# EAGLE design Nixie_Clock_ESP32_IN14 (EAGLE 9.6.2)
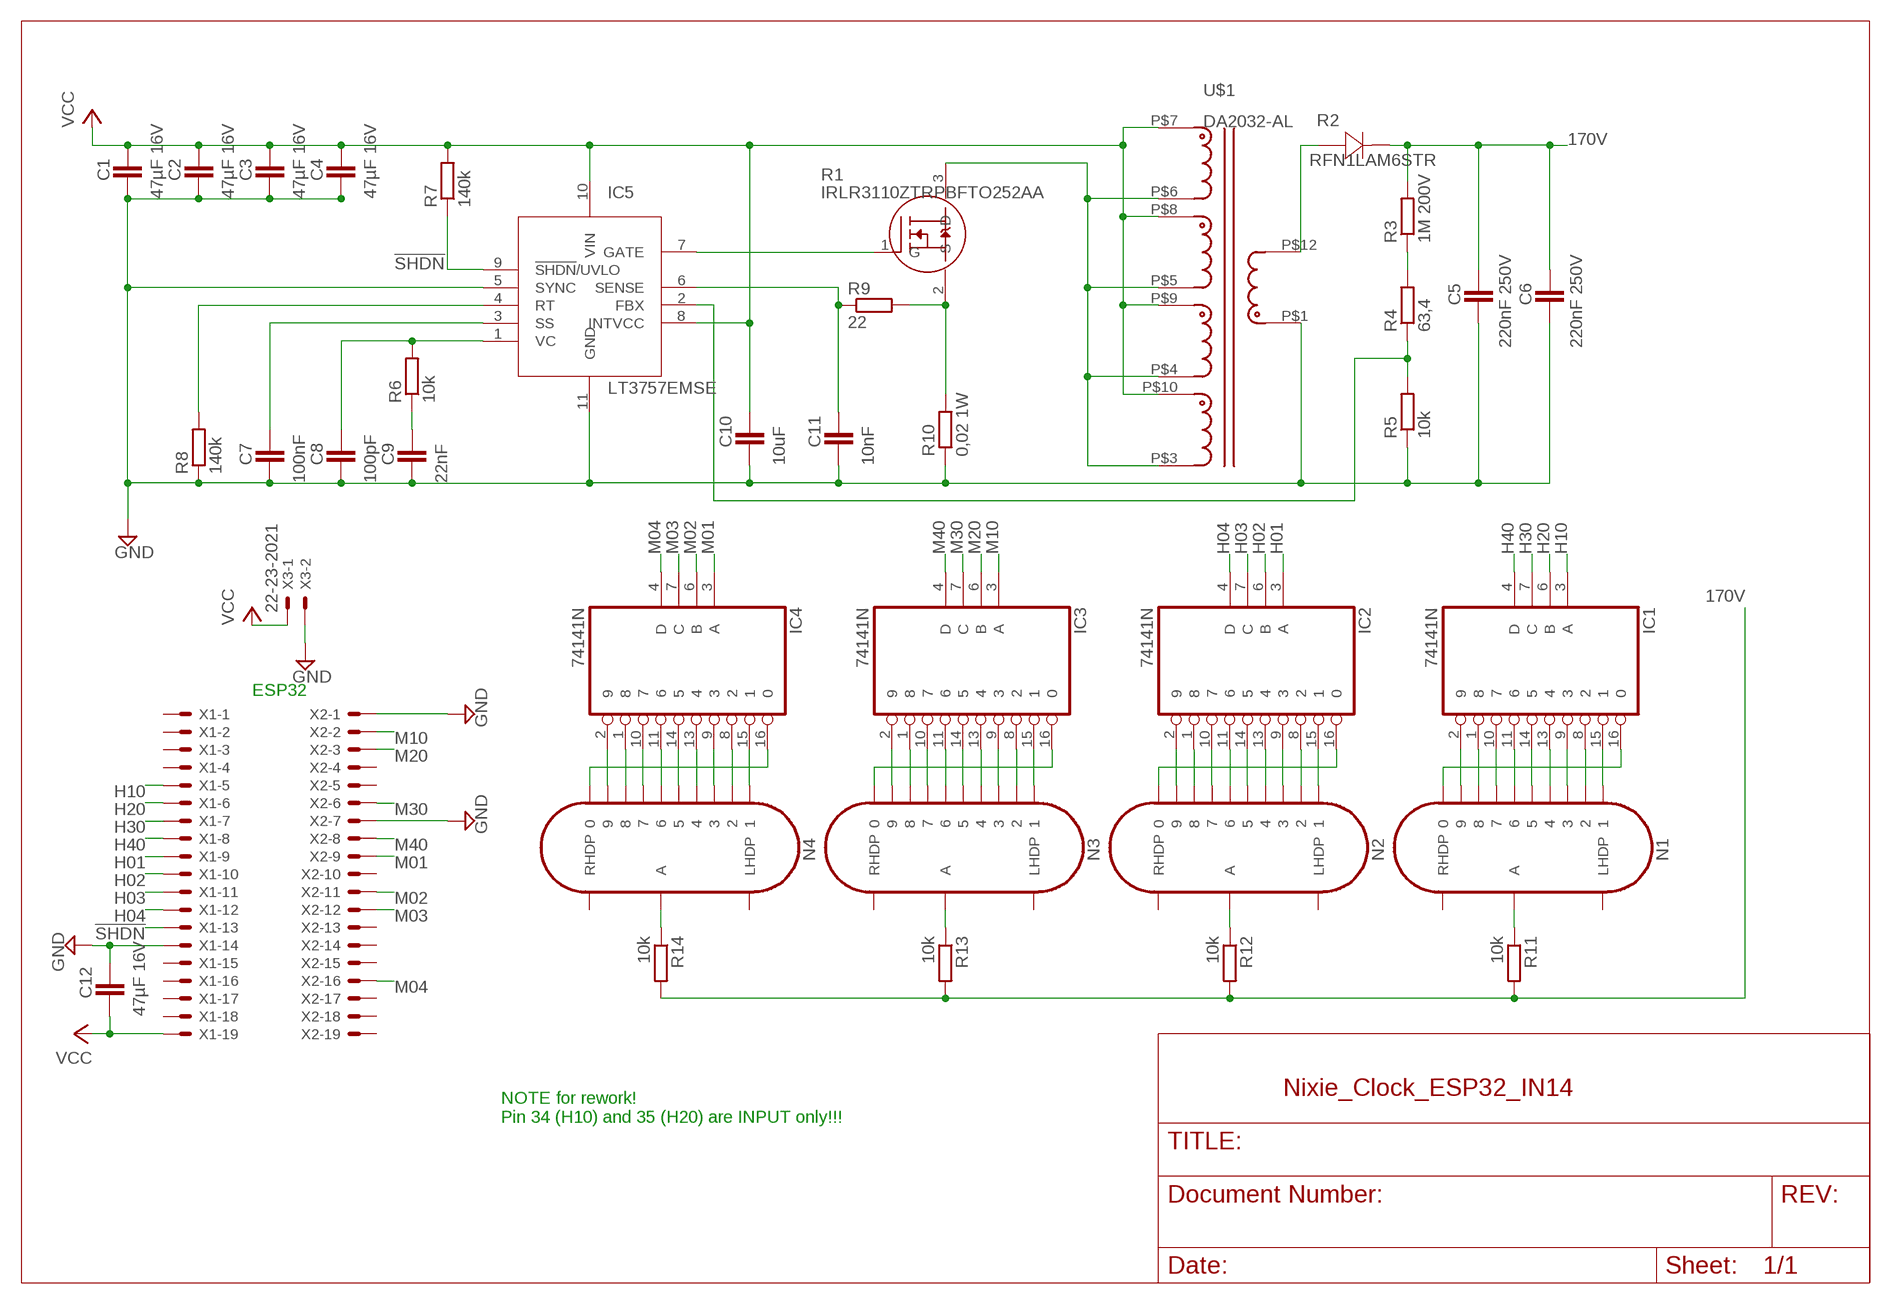
[diagram p0: schematic, sheet 1]

## Parts
C1  47µF 16V  C-EUC1210  [C1210]
C2  47µF 16V  C-EUC1210  [C1210]
C3  47µF 16V  C-EUC1210  [C1210]
C4  47µF 16V  C-EUC1210  [C1210]
C5  220nF 250V  C-EUC1206  [C1206]
C6  220nF 250V  C-EUC1206  [C1206]
C7  100nF  C-EUC0805  [C0805]
C8  100pF  C-EUC0805  [C0805]
C9  22nF  C-EUC0805  [C0805]
C10  10uF  C-EUC0805  [C0805]
C11  10nF  C-EUC0805  [C0805]
C12  47µF 16V  C-EUC1210  [C1210]
IC1  74141N  [DIL16]
IC2  74141N  [DIL16]
IC3  74141N  [DIL16]
IC4  74141N  [DIL16]
IC5  LT3757EMSE  [MSOP10]
N1  IN-14  [IN-14]
N2  IN-14  [IN-14]
N3  IN-14  [IN-14]
N4  IN-14  [IN-14]
R1  IRLR3110ZTRPBFTO252AA  [TO252]
R2  RFN1LAM6STR  [DIO_RB050LAM_ROM]
R3  1M 200V  R-EU_R0805  [R0805]
R4  63,4  R-EU_R0805  [R0805]
R5  10k  R-EU_R0805  [R0805]
R6  10k  R-EU_R0805  [R0805]
R7  140k  R-EU_R0805  [R0805]
R8  140k  R-EU_R0805  [R0805]
R9  22  R-EU_R1206  [R1206]
R10  0,02 1W  R-EU_R2010  [R2010]
R11  10k  R-EU_R0805  [R0805]
R12  10k  R-EU_R0805  [R0805]
R13  10k  R-EU_R0805  [R0805]
R14  10k  R-EU_R0805  [R0805]
U$1  DA2032-AL  [DA2032-AL]
X1  C-GRID-19-70543  [70543-19]
X2  C-GRID-19-70543  [70543-19]
X3  22-23-2021  [22-23-2021]

## Nets
170V [170V]: C5.1 C6.1 R2.1 R3.2 R11.2 R12.2 R13.2 R14.2
!SHDN: IC5.9(!SHDN!/UVLO) R7.1 X1.13
GND [Power]: C1.2 C2.2 C3.2 C4.2 C5.2 C6.2 C7.2 C8.2 C9.2 C10.2 C11.2 C12.1 IC5.5(SYNC) IC5.11(GND) R5.1 R8.1 R10.1 U$1.P$1 X1.14 X2.1 X2.7 X3.2
H01: IC2.3(A) X1.9
H02: IC2.6(B) X1.10
H03: IC2.7(C) X1.11
H04: IC2.4(D) X1.12
H10: IC1.3(A) X1.5
H20: IC1.6(B) X1.6
H30: IC1.7(C) X1.7
H40: IC1.4(D) X1.8
M01: IC4.3(A) X2.9
M02: IC4.6(B) X2.11
M03: IC4.7(C) X2.12
M04: IC4.4(D) X2.16
M10: IC3.3(A) X2.2
M20: IC3.6(B) X2.3
M30: IC3.7(C) X2.6
M40: IC3.4(D) X2.8
N$1: IC1.16 N1.0
N$2 [Power]: R1.3(D) U$1.P$3 U$1.P$4 U$1.P$5 U$1.P$6
N$3: IC5.7(GATE) R1.1(G)
N$4: C11.1 IC5.6(SENSE) R9.1
N$5 [Power]: R1.2(S) R9.2 R10.2
N$6: C7.1 IC5.3(SS)
N$7: C8.1 IC5.1(VC) R6.2
N$8: C9.1 R6.1
N$9: IC5.4(RT) R8.2
N$10: R3.1 R4.2
N$11 [170V]: R2.2 U$1.P$12
N$12: IC1.2 N1.9
N$13: IC5.2(FBX) R4.1 R5.2
N$14: IC1.1 N1.8
N$15: IC1.10 N1.7
N$16: IC1.11 N1.6
N$17: IC1.14 N1.5
N$18: IC1.13 N1.4
N$19: IC1.9 N1.3
N$20: IC1.8 N1.2
N$21: IC1.15 N1.1
N$22: IC2.16 N2.0
N$23: IC2.2 N2.9
N$24: IC2.1 N2.8
N$25: IC2.10 N2.7
N$26: IC2.11 N2.6
N$27: IC2.14 N2.5
N$28: IC2.13 N2.4
N$29: IC2.9 N2.3
N$30: IC2.8 N2.2
N$31: IC2.15 N2.1
N$32: IC3.16 N3.0
N$33: IC3.2 N3.9
N$34: IC3.1 N3.8
N$35: IC3.10 N3.7
N$36: IC3.11 N3.6
N$37: IC3.14 N3.5
N$38: IC3.13 N3.4
N$39: IC3.9 N3.3
N$40: IC3.8 N3.2
N$41: IC3.15 N3.1
N$42: IC4.16 N4.0
N$43: IC4.2 N4.9
N$44: IC4.1 N4.8
N$45: IC4.10 N4.7
N$46: IC4.11 N4.6
N$47: IC4.14 N4.5
N$48: IC4.13 N4.4
N$49: IC4.9 N4.3
N$50: IC4.8 N4.2
N$51: IC4.15 N4.1
N$71: N1.A R11.1
N$72: N2.A R12.1
N$73: N3.A R13.1
N$74: N4.A R14.1
VCC [Power]: C1.1 C2.1 C3.1 C4.1 C10.1 C12.2 IC5.8(INTVCC) IC5.10(VIN) R7.2 U$1.P$7 U$1.P$8 U$1.P$9 U$1.P$10 X1.19 X3.1
Unconnected: N1.LHDP N1.RHDP N2.LHDP N2.RHDP N3.LHDP N3.RHDP N4.LHDP N4.RHDP X1.1 X1.2 X1.3 X1.4 X1.15 X1.16 X1.17 X1.18 X2.4 X2.5 X2.10 X2.13 X2.14 X2.15 X2.17 X2.18 X2.19

## Notes on the sheet
- ESP32
- NOTE for rework!
  Pin 34 (H10) and 35 (H20) are INPUT only!!!

## Power pins joined to a net without a drawn wire
GND: IC1.12(GND) IC2.12(GND) IC3.12(GND) IC4.12(GND)
VCC: IC1.5(VCC) IC2.5(VCC) IC3.5(VCC) IC4.5(VCC)

## Library data of the parts
C1-C12 = rcl:C-EU: CAPACITOR, European symbol; SPICEPREFIX: C
IC1-IC4 = 74xx-eu:74*141: BCD to decimal DECODER/DRIVER
IC5 = OSE2_0:LT3757EMSE: https://www.mouser.de/datasheet/2/609/LT3757_3757A-1635162.pdf
N1-N4 = nixies-us:IN-14: IN-14: medium numeric frontview nixie tube
R1 = costum:IRLR3110ZTRPBF
R2 = costum:RFN1LAM6STR; BUILT_BY: EMA_Matt; COPYRIGHT: Copyright (C) 2018 Accelerated Designs. All rights reserved; MANUFACTURER_PART_NUMBER: RFN1LAM6STR; SOURCELIBRARY: Rohm_2019-09-23; VENDOR: ROHM Semiconductor
R3-R14 = rcl:R-EU_: RESISTOR, European symbol; SPICEPREFIX: R
U$1 = inductor-coilcraft-2:DA2032-AL: Flyback Transformer for Linear Technology LT3750 Reference: http://www.coilcraft.com/da2032.cfm L - 10 uH TurnsRatio Pri:Sec - 1:10 Ipeak - 3.0 A Interwinding capacitance - 67 pF DCRmax: Pri - 0.013, Sec - 1.60 Ohms
X1 X2 = con-molex:C-GRID-19: CONNECTOR wire to board 2.54 mm (0.100") pitch header; MF: MOLEX; OC_FARNELL: unknown; OC_NEWARK: unknown
X3 = con-molex:22-23-2021: .100" (2.54mm) Center Header - 2 Pin; MF: MOLEX; MPN: 22-23-2021; OC_FARNELL: 1462926; OC_NEWARK: 25C3832

## Net classes
1 Power: width 0.508 mm
2 170V: clearance 1.016 mm to class 0, clearance 1.016 mm to class 1, clearance 1.016 mm

## Board
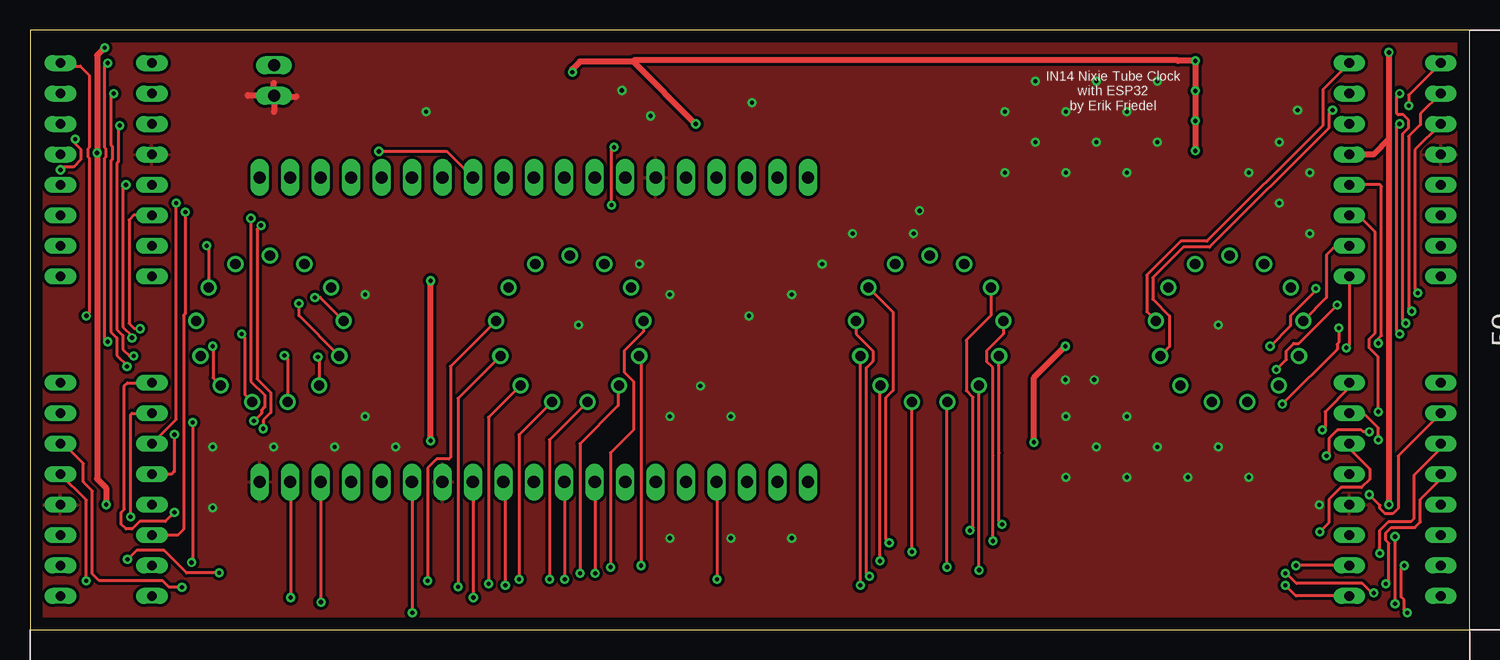
[diagram p1: board, top side]
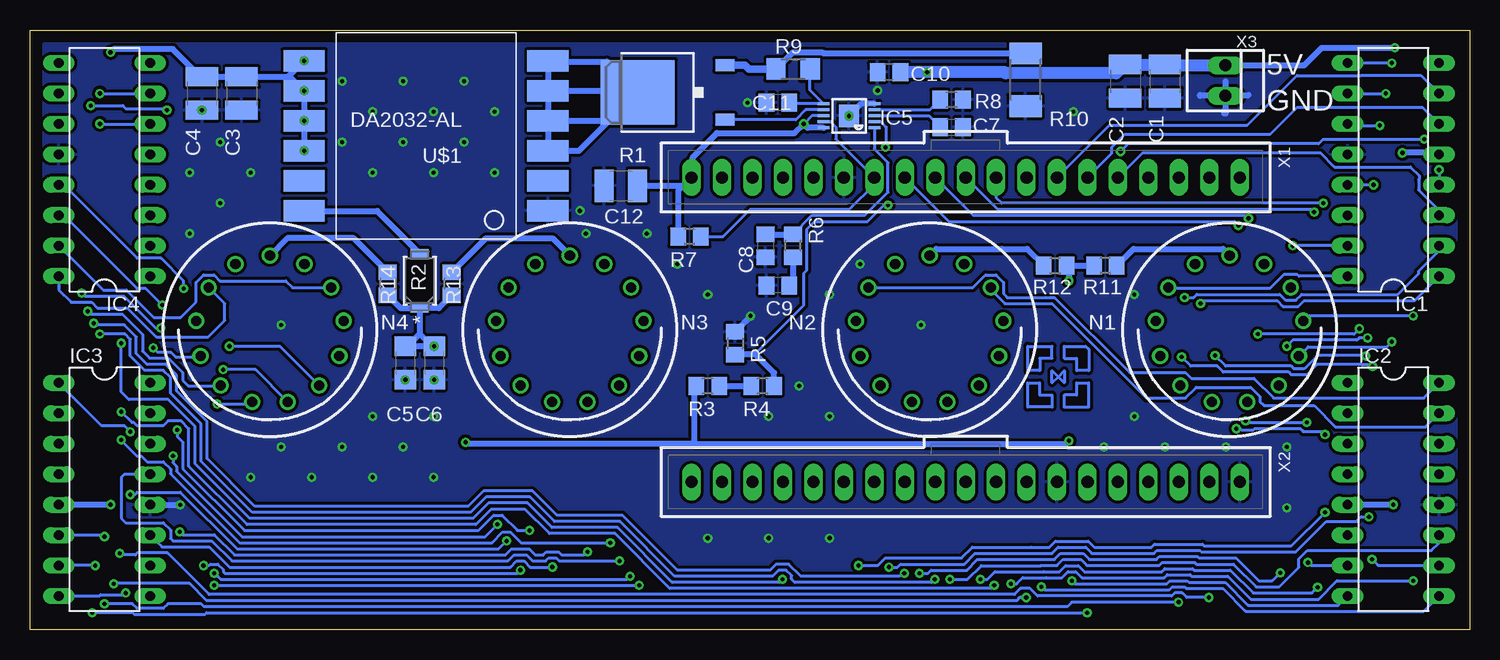
[diagram p2: board, bottom side, seen from below]

Size 120 x 50 mm. Coordinates in mm from the lower left corner, seen from the top.
Outline: 0,0 120,0 120,50 0,50 0,0
Copper layers (1*16): Top 0.035mm / dielectric 1.5mm / Bottom 0.035mm
Design rules "default *": minimum track width 6mil, minimum drill 0.35mm, track to track 10mil, track to pad 10mil, pad to pad 10mil, via to via 10mil, smd to smd 10mil, copper to edge 40mil, drill to drill 6mil, minimum pad ring 10mil, minimum via ring 8mil, stop-mask expansion 4mil, vias tented up to drill 0mil, thermal gap 10mil

### Footprints (pad centres in the part's own frame; a part is rotated, then mirrored left to right if it is on the bottom)
C1210 = smd 1.6 x 2.7: 1 -1.4,0; 2 1.4,0
C1206 = smd 1.6 x 1.8: 1 -1.4,0; 2 1.4,0
C0805 = smd 1.3 x 1.5: 1 -0.95,0; 2 0.95,0
DIL16 = drill 0.813 long: 1 -8.89,-3.81; 2 -6.35,-3.81; 3 -3.81,-3.81; 4 -1.27,-3.81; 5 1.27,-3.81; 6 3.81,-3.81; 7 6.35,-3.81; 8 8.89,-3.81; 9 8.89,3.81; 10 6.35,3.81; 11 3.81,3.81; 12 1.27,3.81; 13 -1.27,3.81; 14 -3.81,3.81; 15 -6.35,3.81; 16 -8.89,3.81
MSOP10 = smd 0.25 x 1: 1 -1,-2.113; 2 -0.5,-2.113; 3 0,-2.113; 4 0.5,-2.113; 5 1,-2.113; 6 1,2.113; 7 0.5,2.113; 8 0,2.113; 9 -0.5,2.113; 10 -1,2.113 | smd 1.88 x 1.676: 11 0,0
IN-14 = drill 0.84: 0 5.094,-3.516; 1 -5.094,-3.516; 2 -6.145,-0.746; 3 -5.788,2.195; 4 -4.105,4.633; 5 -1.481,6.01; 6 1.481,6.01; 7 4.105,4.633; 8 5.788,2.195; 9 6.145,-0.746; A 0,-6.19; LHDP 2.877,-5.481; RHDP -2.877,-5.481
TO252 = smd 1 x 1.6: 1 -2.28,-4.8; 2 2.28,-4.8 | smd 5.4 x 6.2: 3 0,2.5
DIO_RB050LAM_ROM = smd 0.711 x 1.499: 1 -2.273,0; 2 2.273,0
R0805 = smd 1.3 x 1.5: 1 -0.95,0; 2 0.95,0
R1206 = smd 1.6 x 1.803: 1 -1.422,0; 2 1.422,0
R2010 = smd 1.8 x 2.7: 1 -2.2,0; 2 2.2,0
DA2032-AL = smd 3.43 x 1.79: P$1 -10.16,6.25; P$2 -10.16,3.75; P$3 -10.16,1.25; P$4 -10.16,-1.25; P$5 -10.16,-3.75; P$6 -10.16,-6.25; P$7 10.16,-6.25; P$8 10.16,-3.75; P$9 10.16,-1.25; P$10 10.16,1.25; P$11 10.16,3.75; P$12 10.16,6.25
70543-19 = drill 1.016 long: 1 -22.86,0; 2 -20.32,0; 3 -17.78,0; 4 -15.24,0; 5 -12.7,0; 6 -10.16,0; 7 -7.62,0; 8 -5.08,0; 9 -2.54,0; 10 0,0; 11 2.54,0; 12 5.08,0; 13 7.62,0; 14 10.16,0; 15 12.7,0; 16 15.24,0; 17 17.78,0; 18 20.32,0; 19 22.86,0
22-23-2021 = drill 1 long: 1 -1.27,0; 2 1.27,0

### Placement (x,y rotation side)
C1  25.4,45.72 270 bottom
C2  28.7,45.72 270 bottom
C3  102.36,44.7 270 bottom
C4  105.66,44.7 270 bottom
C5  88.72,22.23 270 bottom
C6  86.3,22.23 270 bottom
C7  43.18,41.91 0 bottom
C8  58.67,32 270 bottom
C9  57.66,28.7 180 bottom
C10  48.39,46.48 180 bottom
C11  57.66,43.94 180 bottom
C12  70.74,37.01 0 bottom
IC1  6.35,38.35 90 bottom
IC2  6.35,11.68 270 bottom
IC3  113.79,11.68 270 bottom
IC4  113.79,38.35 90 bottom
IC5  51.72,42.83 90 bottom
N1  20,25 180 bottom
N2  45,25 180 bottom
N3  75,25 180 bottom
N4  100,25 180 bottom
R1  66.86,44.8 90 bottom
R2  87.5,29.08 90 bottom
R3  63.5,20.32 180 bottom
R4  58.93,20.32 180 bottom
R5  61.21,23.88 270 bottom
R6  56.39,32 90 bottom
R7  65.02,32.77 180 bottom
R8  43.18,44.2 180 bottom
R9  56.39,46.74 180 bottom
R10  37.01,45.84 90 bottom
R11  30.35,30.35 180 bottom
R12  34.54,30.35 0 bottom
R13  84.84,28.83 270 bottom
R14  90.17,28.83 270 bottom
U$1  86.99,41.17 180 bottom
X1  42,37.7 180 bottom
X2  42,12.3 180 bottom
X3  20.35,45.79 270 bottom

### Tracks (layer width: path | path; a pad name or v marks a point on that pad's centre or on a via)
170V  (via drill 0.35)
  Top 0.508: v83.69,15.62 83.69,21.02 C6.1 | v33.4,15.74 v33.4,29.08
  Bottom 0.508: R11.2 R12.2 33.59,29.91 33.4,29.72 v33.4,29.08 | R14.2 89.1,26.81 R2.1 | R13.2 85.91,26.81 R2.1 | R2.1 87.5,24.64 | 87.5,24.64 86.49,23.63 C6.1 C5.1 88.51,23.63 87.5,24.64 | 64.64,15.49 83.57,15.49 v83.69,15.62 | R3.2 64.64,20.13 64.64,15.49 | v33.4,15.74 33.65,15.49 64.64,15.49
  other vias: 86.3,23.63
!SHDN
  Bottom 0.254: IC5.9 53.26,42.33 52.83,41.91 52.83,40.91 X1.13 49.62,37.12 51.69,35.05 59.94,35.05 62.23,32.77 R7.1
GND  (via drill 0.35)
  Top 0.508: X3.2 20.35,44.45 22.23,44.45 | X3.2 18.16,44.52 18.16,44.58 | X3.2 20.35,43.18 20.32,43.18 | X3.2 20.32,44.52 20.32,45.59
  Bottom 0.508: IC5.5 50.72,43.83 IC5.11 | R5.1 59.94,26.1 v59.94,26.16 | IC3.12 109.95,10.39 v107.47,10.39 | X3.2 22.48,44.52 22.48,44.58 | X3.2 20.35,44.58 18.41,44.58 | X3.2 20.35,43.05 20.45,43.05 | X3.2 20.32,44.52 20.32,45.69
  other vias: 60.2,43.94 51.72,42.83 49.34,44.96 74.16,34.92 86.3,20.83 88.72,20.83 105.66,43.3 101.6,12.7 53.34,17.78 55.88,20.32 58.42,17.78 53.34,7.62 58.42,7.62 63.5,7.62 15.24,10.16 15.24,15.24 20.32,15.24 25.4,15.24 27.94,17.78 30.48,15.24 27.94,27.94 33.02,43.18 45.72,25.4 53.34,27.94 50.8,30.48 68.58,33.02 66.04,30.48 63.5,27.94 73.66,33.02 83.82,45.72 81.28,43.18 81.28,38.1 83.82,40.64 86.36,38.1 86.36,43.18 88.9,45.72 88.9,40.64 91.44,38.1 93.98,40.64 91.44,43.18 93.98,45.72 99.06,25.4 101.6,38.1 104.14,40.64 106.68,38.1 104.14,35.56 106.68,33.02 99.06,15.24 96.52,12.7 93.98,15.24 91.44,12.7 91.44,17.78 86.36,12.7 88.9,15.24 86.36,17.78
  pour Bottom: 0,50 120,50 120,0 0,0
  pour Top: 0,50 120,50 120,0 0,0
H01  (via drill 0.35)
  Top 0.254: IC2.3 12.19,17.53 v12.19,35.56
  Bottom 0.254: X1.9 39.46,36.03 38.99,35.56 v12.19,35.56
H02  (via drill 0.35)
  Top 0.254: v12.95,34.8 12.95,26.33 12.8,26.18 12.8,8.36 12.32,7.87 IC2.6
  Bottom 0.254: X1.10 39.35,35.05 13.2,35.05 v12.95,34.8
H03  (via drill 0.35)
  Top 0.254: v18.41,34.29 18.41,20.7 19.57,19.54 19.57,18.55 19.3,18.28 19.3,18.03 v18.67,17.4 | v13.56,17.27 13.56,5.68 v13.46,5.59
  Bottom 0.254: X1.11 41.38,34.54 18.41,34.54 v18.41,34.29 | v18.67,17.4 18.54,17.27 v13.56,17.27 | v13.46,5.59 13.21,5.33 IC2.7
H04  (via drill 0.35)
  Top 0.254: v19.25,33.7 18.92,33.37 18.92,20.91 20.08,19.75 20.08,18.09 19.45,17.46 v19.45,16.75 | v12.04,16.26 12.04,13.18 11.81,12.95 IC2.4
  Bottom 0.254: X1.12 43.42,34.04 19.59,34.04 v19.25,33.7 | v19.45,16.75 19.09,16.75 18.98,16.64 18.03,16.64 17.91,16.76 14.12,16.76 13.87,16.51 12.3,16.51 v12.04,16.26
H10
  Bottom 0.254: IC1.3 2.54,34.95 4.24,36.65 4.24,37.52 4.19,37.57 4.19,37.85 4.93,38.58 11.25,38.58 12.4,39.73 27.27,39.73 X1.5
H20
  Bottom 0.254: IC1.6 3.94,43.56 14.35,43.56 16.64,41.27 28.76,41.27 29.84,40.19 29.84,39.7 X1.6
H30
  Bottom 0.254: IC1.7 4.06,46.23 9.04,46.23 9.07,46.2 14.38,46.2 18.54,42.04 30.04,42.04 X1.7
H40  (via drill 0.35)
  Top 0.254: v29.08,39.88 34.74,39.88 X1.8 | v3.76,40.89 3.76,40.54 4.24,40.05 4.24,39.19 3.63,38.58 2.79,38.58 v2.54,38.33
  Bottom 0.254: v29.08,39.88 28.45,40.51 12.57,40.51 12.19,40.89 v3.76,40.89 | v2.54,38.33 IC1.4
M01  (via drill 0.35)
  Top 0.254: X2.9 39.46,11.59 39.62,11.43 v39.62,3.68 | v112.39,18.16 112.39,19.3 112.39,22.73 111.64,23.49 111.64,24.22 112.14,24.72 112.14,33.15 110.74,34.54 IC4.3
  Bottom 0.254: v39.62,3.68 39.88,3.43 66.67,3.43 71.24,8 76.7,8 78.74,10.03 81.56,10.03 82.83,8.76 101.9,8.76 106.76,13.62 106.76,16.74 107.41,17.4 108.49,17.4 108.89,16.99 111.07,16.99 111.33,17.25 111.49,17.25 v112.39,18.16
M02  (via drill 0.35)
  Top 0.254: X2.11 44.54,11.72 44.58,11.68 v44.58,4.19 | v114.17,24.64 113.92,24.89 113.92,41.91 v114.17,42.16
  Bottom 0.254: v44.58,4.19 44.83,3.94 56.26,3.94 56.52,4.19 56.52,4.5 56.96,4.95 57.59,4.95 58.09,4.45 66.25,4.45 70.82,9.02 76.28,9.02 78.32,11.05 81.98,11.05 83.25,9.78 101.48,9.78 105.74,14.04 105.74,17.16 108.28,19.7 108.28,21 108.89,21.61 110.45,21.61 111.64,22.81 111.64,24.19 112.08,24.64 v114.17,24.64 | v114.17,42.16 IC4.6
M03  (via drill 0.35)
  Top 0.254: X2.12 47.12,12.26 v47.12,4.7 | v114.7,25.54 114.43,25.81 114.43,41.35 114.93,41.85 114.93,42.48 114.48,42.92 114.05,42.92 113.92,43.05 113.92,44.45 v114.17,44.7
  Bottom 0.254: v47.12,4.7 47.25,4.7 47.5,4.45 55.74,4.45 56.75,5.46 57.8,5.46 58.3,4.95 66.04,4.95 70.61,9.53 76.07,9.53 78.11,11.56 82.19,11.56 83.46,10.29 101.27,10.29 105.23,14.25 105.23,17.37 107.77,19.91 107.77,21.22 108.68,22.12 110.24,22.12 111.13,23.02 111.13,24.4 112.13,25.4 114.55,25.4 v114.7,25.54 | v114.17,44.7 IC4.7
M04  (via drill 0.35)
  Top 0.254: X2.16 57.24,11.72 57.28,11.68 v57.28,4.19 | v112.4,23.88 112.4,24.26 112.65,24.51 112.65,36.96 112.52,37.08 IC4.4
  Bottom 0.254: v57.28,4.19 57.53,3.94 66.46,3.94 71.03,8.51 76.49,8.51 78.53,10.54 81.77,10.54 83.04,9.27 101.69,9.27 106.25,13.83 106.25,16.95 108.47,19.18 111.76,19.18 112.39,19.81 v112.39,23.87 v112.4,23.88
M10  (via drill 0.35)
  Top 0.254: X2.2 21.68,11.59 21.72,11.56 v21.72,2.67 | v112.53,6.35 112.53,8.27 113.27,9.02 115.14,9.02 115.39,9.27 115.39,12.88 117.6,15.09 IC3.3
  Bottom 0.254: v21.72,2.67 23.56,2.67 23.94,3.04 24.57,3.04 24.82,2.79 36.01,2.79 36.64,3.43 37.42,3.43 37.93,2.92 105.07,2.92 108.53,6.38 111.07,6.38 111.23,6.22 112.4,6.22 v112.53,6.35
M20  (via drill 0.35)
  Top 0.254: X2.3 24.22,2.32 v24.26,2.29 | v113.79,2.16 v113.79,7.75
  Bottom 0.254: v24.26,2.29 33.15,2.29 33.53,1.91 105.49,1.91 105.75,2.16 108.49,2.16 108.89,1.75 111.07,1.75 111.48,2.16 v113.79,2.16 | v113.79,7.75 113.92,7.87 IC3.6
M30  (via drill 0.35)
  Top 0.254: X2.6 31.84,1.43 v31.88,1.39 | v114.8,1.39 114.55,1.65 114.55,2.47 114.3,2.72 114.3,5.08 v114.55,5.33
  Bottom 0.254: v114.8,1.39 111.43,1.39 111.28,1.25 105.44,1.25 105.28,1.4 v31.88,1.4 v31.88,1.39 | v114.55,5.33 IC3.7
M40  (via drill 0.35)
  Top 0.254: X2.8 36.92,11.72 36.96,11.68 v36.96,2.67 | v113.03,3.81 113.28,4.06 113.28,7.18 113.03,7.43 113.03,8.06 113.48,8.51 115.44,8.51 115.9,8.97 115.9,10.85 117.6,12.55 IC3.4
  Bottom 0.254: v36.96,2.67 37.47,2.67 37.72,2.41 105.28,2.41 106.7,3.83 113.01,3.83 v113.03,3.81
N$1
  Bottom 0.254: IC1.16 14.22,29.46 14.35,29.59 15.49,29.59 16.64,28.45 25.03,28.45 N1.0
N$2
  Bottom 0.508: R1.3 71.93,47.37 76.78,47.37 U$1.P$6 U$1.P$3 74.23,39.92 R1.3 | U$1.P$5 69.48,44.92 R1.3 | U$1.P$4 71.73,42.42 R1.3
N$3
  Bottom 0.254: IC5.7 55.34,43.33 56.16,42.52 R1.1
N$4
  Bottom 0.254: C11.1 56.6,43.83 IC5.6 54.97,44.96 R9.1
N$5
  Bottom 0.508: R10.2 53.85,48.04 53.96,48.15 56.4,48.15 R9.2
  Bottom 0.61: R1.2 60.41,47.08 60.07,46.74 R9.2
N$6
  Bottom 0.254: IC5.3 45.05,42.83 C7.1
N$7
  Bottom 0.254: R6.2 54.8,34.54 50.4,34.54 48.48,36.47 48.48,38.94 49.61,40.07 IC5.1
  Bottom 0.508: C8.1 R6.2
N$8
  Bottom 0.508: R6.1 56.39,29.02 C9.1
N$9
  Bottom 0.254: IC5.4 44.99,43.33 R8.2
N$10
  Bottom 0.508: R3.1 R4.2
N$11
  Bottom 0.508: U$1.P$12 91.06,34.91 R2.2
N$12  (via drill 0.35)
  Top 0.254: N1.9 24.2,27.69 v23.75,27.69
  Bottom 0.254: v23.75,27.69 22.98,27.69 22.73,27.94 15.82,27.94 15.34,27.46 14.47,27.46 13.99,27.94 5.97,27.94 4.24,29.67 4.24,29.89 2.54,31.6 IC1.2
N$13  (via drill 0.35)
  Top 0.254: v48.47,35.39 48.47,40.01 v48.68,40.22
  Bottom 0.254: R5.2 59.62,22.93 55.5,27.05 55.5,29.72 55.24,29.97 55.24,33.38 54.59,34.04 50.19,34.04 48.83,35.39 v48.47,35.39 | IC5.2 49.06,42.33 48.64,41.91 48.64,40.26 v48.68,40.22
  Bottom 0.508: R4.1 57.98,21.4 59.5,22.93 R5.2
N$14  (via drill 0.35)
  Top 0.254: N1.8 22.42,26.17 v22.42,27.18
  Bottom 0.254: v22.42,27.18 22.17,27.43 16.03,27.43 15.55,26.95 14.26,26.95 13.78,27.43 4.57,27.43 IC1.1
N$15  (via drill 0.35)
  Top 0.254: v6.98,44.7 6.73,44.45 6.73,40.4 6.86,40.28 6.86,39.23 6.73,39.1 6.73,24.82 7.23,24.32 7.23,22.87 8.09,22.01 v8.09,21.93 | v24,22.73 24.11,22.63 N1.7
  Bottom 0.254: IC1.10 v6.98,44.7 | v8.09,21.93 8.21,22.05 8.95,22.05 9,22.1 12.71,22.1 13.56,21.24 14.86,21.24 15.08,21.46 20.53,21.46 21.04,21.97 23.24,21.97 v24,22.73
N$16  (via drill 0.35)
  Top 0.254: v7.49,42.04 7.36,41.91 7.36,39.02 7.24,38.89 7.24,25.03 7.74,24.53 7.74,23.37 8.31,22.81 v8.64,22.81 | v21.21,22.86 21.48,22.59 N1.6
  Bottom 0.254: IC1.11 10.03,42.04 v7.49,42.04 | v8.64,22.81 8.69,22.86 12.66,22.86 13.78,21.75 14.65,21.75 14.87,21.97 20.32,21.97 v21.21,22.86
N$17  (via drill 0.35)
  Top 0.254: IC1.14 8.64,34.54 8.26,34.16 8.26,25.53 8.7,25.09 v9.17,25.09 | v17.66,24.64 17.91,24.39 17.91,19.6 N1.5
  Bottom 0.254: v9.17,25.09 9.62,24.64 v17.66,24.64
N$18  (via drill 0.35)
  Top 0.254: v8,37.08 7.75,36.83 7.75,25.24 8.5,24.49 v8.5,24.33 | v15.24,23.62 15.24,23.27 15.27,23.24 15.27,21 N1.4
  Bottom 0.254: IC1.13 v8,37.08 | v8.5,24.33 9.2,24.33 9.4,24.13 14.73,24.13 v15.24,23.62
N$19  (via drill 0.35)
  Top 0.254: v6.47,24 6.22,24.25 6.22,39.31 6.35,39.44 6.35,40.06 6.22,40.19 6.22,46.99 v6.47,47.24
  Bottom 0.254: N1.3 13.45,23.57 6.91,23.57 v6.47,24 | v6.47,47.24 IC1.9
N$20  (via drill 0.35)
  Top 0.254: IC1.8 2.79,46.99 4.19,46.99 4.95,46.23 4.95,40.19 4.83,40.06 4.83,39.44 4.95,39.31 4.95,26.41 v4.7,26.16
  Bottom 0.254: v4.7,26.16 13.44,26.16 N1.2
N$21  (via drill 0.35)
  Top 0.254: v14.73,32 14.91,31.83 N1.1
  Bottom 0.254: IC1.15 v14.73,32
N$22
  Bottom 0.254: N2.0 41.4,28.52 40.34,29.57 39.47,29.57 38.85,28.95 38.85,28.01 38.52,27.69 34.59,27.69 28.32,21.42 23.67,21.42 23.2,20.95 17.98,20.95 16.33,19.31 3.8,19.31 IC2.16
N$23  (via drill 0.35)
  Top 0.254: N2.9 51.15,24.86 49.53,23.24 49.53,21.46 50.29,20.7 50.29,16.64 48.39,14.73 v48.39,5.2 | v8.38,9.4 8.38,17.91 8.51,18.03 IC2.2
  Bottom 0.254: v48.39,5.2 47.68,5.2 47.43,5.46 42.12,5.46 41.23,6.35 36.33,6.35 36.32,6.35 34.81,6.35 34.3,6.86 31.99,6.86 31.49,6.35 26.3,6.35 26.04,6.6 22.47,6.6 22.34,6.47 14.48,6.47 11.94,9.02 9.42,9.02 9.04,9.4 v8.38,9.4
N$24  (via drill 0.35)
  Top 0.254: N2.8 50.93,22.67 v50.93,5.33 | v12.04,9.78 11.28,9.02 9.14,9.02 8.51,8.38 8,8.38 7.62,8.76 7.62,9.78 7.87,10.03 7.87,20.32 8.13,20.57 IC2.1
  Bottom 0.254: v50.93,5.33 49.33,5.33 48.7,5.97 42.33,5.97 41.45,6.86 36.53,6.86 35.02,6.86 34.51,7.36 31.78,7.36 31.27,6.86 26.51,6.86 26.25,7.11 22.26,7.11 22.13,6.98 14.84,6.98 v12.04,9.78
N$25  (via drill 0.35)
  Top 0.254: N2.7 49.02,20.28 49.02,18.67 45.85,15.49 v45.85,4.7 | v15.78,4.73 13.05,4.73 11.18,6.6 8.89,6.6 v8.13,5.84
  Bottom 0.254: v45.85,4.7 45.14,4.7 44.89,4.95 41.91,4.95 41.02,5.84 35.94,5.84 34.6,5.84 34.09,6.35 32.2,6.35 31.7,5.84 26.09,5.84 25.83,6.09 22.68,6.09 22.55,5.97 19.47,5.97 17.57,4.06 16.44,4.06 v15.78,4.73 | v8.13,5.84 7.62,5.33 IC2.10
N$26  (via drill 0.35)
  Top 0.254: N2.6 43.31,15.82 v43.31,4.19
  Bottom 0.254: v43.31,4.19 41.84,4.19 40.7,5.33 35.73,5.33 34.39,5.33 33.88,5.84 32.41,5.84 31.91,5.33 25.88,5.33 25.62,5.58 22.89,5.58 22.76,5.46 19.68,5.46 17.78,3.56 15.88,3.56 14.22,5.21 14.22,5.9 13.52,6.6 3.17,6.6 2.54,7.24 IC2.11
N$27  (via drill 0.35)
  Top 0.254: N2.5 40.77,16.24 v40.77,4.19 | v12.66,3.52 11.59,3.52 11.05,4.06 5.77,4.06 5.21,4.63 5.21,11.56 4.45,12.32 4.45,13.84 2.79,15.49 IC2.14
  Bottom 0.254: v40.77,4.19 40.19,4.19 39.55,4.82 35.52,4.82 35.52,4.83 34.18,4.83 33.67,5.33 32.62,5.33 32.12,4.83 25.66,4.83 25.41,5.08 23.1,5.08 22.97,4.95 19.94,4.95 18.04,3.05 13.14,3.05 v12.66,3.52
N$28  (via drill 0.35)
  Top 0.254: N2.4 38.23,17.7 v38.23,3.81 | v4.7,4.06 4.7,10.79 IC2.13
  Bottom 0.254: v38.23,3.81 37.76,3.81 37.25,4.32 35.31,4.32 33.97,4.32 33.46,4.82 32.83,4.82 32.33,4.32 25.45,4.32 25.2,4.57 23.31,4.57 23.18,4.44 20.15,4.44 18.25,2.54 12.57,2.54 11.05,4.06 v4.7,4.06
N$29  (via drill 0.35)
  Top 0.254: N2.3 35.69,19.28 v35.69,3.56
  Bottom 0.254: v35.69,3.56 35.43,3.3 25.03,3.3 24.78,3.55 23.73,3.55 23.61,3.43 20.57,3.43 18.67,1.52 3.81,1.52 IC2.9
N$30  (via drill 0.35)
  Top 0.254: N2.2 35.05,21.94 35.05,14.35 34.92,14.22 33.91,14.22 33.15,13.46 v33.15,4.06
  Bottom 0.254: v33.15,4.06 32.89,3.81 25.24,3.81 24.99,4.06 23.52,4.06 23.39,3.93 20.36,3.93 18.46,2.03 10.92,2.03 IC2.8
N$31
  Bottom 0.254: N2.1 39.91,28.35 38.73,27.18 34.8,27.18 26.93,19.31 23.67,19.31 22.79,20.19 18.23,20.19 17.46,19.43 17.46,18.99 17.14,18.67 12.95,18.67 11.18,16.89 3.68,16.89 IC2.15
N$32  (via drill 0.35)
  Top 0.254: N3.0 80.09,26.19 78.05,24.14 78.05,19.93 78.61,19.37 78.61,8.51 v78.36,8.26 | v107.73,16.64 107.98,16.89 107.98,18.16 109.98,20.17 IC3.16
  Bottom 0.254: v107.73,16.64 107.73,16.09 107.26,15.63 107.26,13.41 102.11,8.26 82.62,8.26 81.35,9.53 80.63,9.53 79.36,8.26 v78.36,8.26
N$33  (via drill 0.35)
  Top 0.254: N3.9 81.14,24.65 79.73,23.24 79.73,22.37 80.26,21.84 80.26,14.52 80.28,14.51 v80.28,7.38 | IC3.2 114.04,14.47 114.04,10.1 113.6,9.65 112.97,9.65 112.53,10.1 112.53,10.36 v111.64,11.25
  Bottom 0.254: v111.64,11.25 111.28,11.25 111.07,11.46 107.47,11.46 102.74,6.73 80.92,6.73 v80.28,7.38
N$34  (via drill 0.35)
  Top 0.254: N3.8 80.79,22.24 80.77,22.23 80.77,14.73 80.78,14.72 80.78,9.02 v81.04,8.77 | v111.65,16.49 111.14,16.49 111,16.64 108.99,16.64 108.28,15.93 108.28,14.68 v108.08,14.48
  Bottom 0.254: IC3.1 114.05,17.02 112.14,17.02 111.65,16.53 v111.65,16.49 | v81.04,8.77 82.06,7.75 102.32,7.75 107.77,13.2 107.77,13.6 108.08,13.9 v108.08,14.48
N$35  (via drill 0.35)
  Top 0.254: N3.7 79.11,19.83 79.12,19.81 v79.12,4.95 | IC3.10 v105.54,5.33
  Bottom 0.254: v105.54,5.33 105.08,5.33 104.96,5.45 104.33,5.45 103.89,5 103.89,4.83 103.76,4.7 79.37,4.7 v79.12,4.95
N$36  (via drill 0.35)
  Top 0.254: N3.6 76.48,18.44 76.45,18.41 v76.45,5.21
  Bottom 0.254: IC3.11 108.99,6.88 105.05,6.88 103.37,5.21 79.94,5.21 79.44,5.71 78.81,5.71 78.3,5.21 v76.45,5.21
N$37  (via drill 0.35)
  Top 0.254: N3.5 73.52,18.43 73.53,18.41 v73.53,6.47 | IC3.14 109.98,15.09 111.68,13.38 111.68,12.52 111,11.84 109.27,11.84 108.28,10.85 108.28,8.91 v107.52,8.15
  Bottom 0.254: v107.52,8.15 107.27,7.9 104.63,7.9 102.95,6.22 80.36,6.22 79.86,6.72 78.39,6.72 77.89,6.23 77.22,6.23 76.98,6.47 75.93,6.47 75.68,6.22 73.78,6.22 v73.53,6.47
N$38  (via drill 0.35)
  Top 0.254: N3.4 70.89,19.84 70.87,19.81 v70.87,5.71
  Bottom 0.254: IC3.13 112.14,12.95 112.39,12.7 112.39,9.27 112.04,8.91 108.89,8.91 108.28,8.3 108.28,7.59 108.08,7.39 104.84,7.39 103.16,5.71 80.15,5.71 79.65,6.22 78.6,6.22 78.1,5.72 77.01,5.72 76.77,5.97 76.14,5.97 75.89,5.71 v70.87,5.71
N$39  (via drill 0.35)
  Top 0.254: IC3.9 105.53,2.79 v104.65,3.68 | N3.3 69.21,22.23 69.22,22.23 v69.22,3.68
  Bottom 0.254: v104.65,3.68 103.64,3.68 103.63,3.68 v69.22,3.68
N$40  (via drill 0.35)
  Top 0.254: v104.65,4.69 104.9,4.44 104.96,4.44 105.57,3.83 111.07,3.83 111.86,3.05 v112.01,3.05 | N3.2 68.86,24.65 70.27,23.24 70.27,22.37 69.72,21.82 69.72,4.69 v69.97,4.44
  Bottom 0.254: IC3.8 114.23,2.79 114.11,2.92 112.15,2.92 v112.01,3.05 | v104.65,4.69 104.4,4.44 104.33,4.44 104.08,4.19 70.22,4.19 v69.97,4.44
N$41  (via drill 0.35)
  Top 0.254: N3.1 71.95,26.47 71.95,19.93 71.37,19.35 71.37,7.49 v71.62,7.24 | v112.4,15.81 112.4,16.17 112.41,16.18 112.41,16.81 111.18,18.03 IC3.15
  Bottom 0.254: v71.62,7.24 79.06,7.24 79.96,8.14 80.59,8.14 81.49,7.24 102.53,7.24 108.28,12.99 108.28,13.38 108.89,13.99 110.24,13.99 110.69,14.45 111.07,14.45 112.4,15.78 v112.4,15.81
N$42
  Bottom 0.254: IC4.16 117.6,28.32 116.58,27.3 114.88,27.3 114.38,26.81 111.9,26.81 109.47,24.38 105.16,24.38 103.76,25.78 103.76,27.18 N4.0
N$43
  Top 0.254: IC4.2 109.86,31.88 108.71,31.88 108.08,31.24 108.08,27.68 N4.9
N$44  (via drill 0.35)
  Top 0.254: v109.73,23.5 109.98,23.75 IC4.1
  Bottom 0.254: v109.73,23.5 109.37,23.14 108.26,23.14 107.85,22.73 105.86,22.73 N4.8
N$45  (via drill 0.35)
  Top 0.254: IC4.10 115.9,43 115.9,42.1 114.94,41.14 114.94,26.8 v115.19,26.54
  Bottom 0.254: v115.19,26.54 114.95,26.3 112.31,26.3 110.62,24.61 110.62,23.23 110.03,22.63 108.47,22.63 107.26,21.43 107.26,20.78 106.81,20.32 104.15,20.32 N4.7
N$46  (via drill 0.35)
  Top 0.254: IC4.11 115.44,40.01 115.44,28.32 v115.69,28.07 | v109.09,25.14 109.09,23.93 108.97,23.81 108.97,23.37 v104.39,18.8
  Bottom 0.254: v115.69,28.07 115.44,27.81 112.18,27.81 109.52,25.14 v109.09,25.14 | v104.39,18.8 101.67,18.8 N4.6
N$47  (via drill 0.35)
  Top 0.254: v103.89,21.67 104.73,22.52 104.73,23.24 105.35,23.86 105.78,23.86 v108.97,27.05
  Bottom 0.254: N4.5 101.2,21.67 v103.89,21.67 | v108.97,27.05 110.34,28.42 111.07,28.42 117.19,34.54 IC4.14
N$48  (via drill 0.35)
  Top 0.254: v103.38,23.62 105.09,25.33 105.09,26.18 107.19,28.28 v107.19,28.45
  Bottom 0.254: N4.4 99.15,23.62 v103.38,23.62 | v107.19,28.45 107.19,29.08 109.07,30.96 111.07,30.96 117.19,37.08 IC4.13
N$49  (via drill 0.35)
  Top 0.254: IC4.9 114.94,44.58 v114.94,43.69 | v108.58,43.31 108.28,43 108.28,41.83 98.33,31.88 96.14,31.88 93.6,29.34 93.6,27.56 95,26.16 95,23.59 N4.3
  Bottom 0.254: v114.94,43.69 112.27,43.69 112.01,43.43 108.71,43.43 v108.58,43.31
N$50
  Top 0.254: IC4.8 107.77,45.03 107.77,42.04 98.12,32.38 95.93,32.38 93.09,29.55 93.09,26.51 N4.2
N$51
  Bottom 0.254: IC4.15 113.92,28.32 111.97,28.32 109.69,26.04 107.44,26.04 106.15,27.33 106.15,28.95 105.53,29.57 104.66,29.57 104.17,29.08 98.68,29.08 98.11,28.52 N4.1
N$52
  Bottom 0.254: 34.29,21.08 34.8,20.57 34.8,21.59 34.29,21.08 | 34.29,21.08 33.78,21.59 33.78,20.57 34.29,21.08 | 33.78,22.61 32.77,22.61 32.77,21.59 31.75,21.59 31.75,23.37 32,23.62 33.78,23.62 33.78,22.61 | 32.77,20.57 31.75,20.57 31.75,18.54 33.78,18.54 33.78,19.56 32.77,19.56 32.77,20.57 | 34.8,19.56 34.8,18.54 36.83,18.54 36.83,20.57 35.81,20.57 35.81,19.56 34.8,19.56 | 35.81,21.59 36.83,21.59 36.83,23.62 34.8,23.62 34.8,22.61 35.81,22.61 35.81,21.59
N$71
  Bottom 0.508: R11.1 28.01,31.75 20.56,31.75 N1.A
N$72
  Bottom 0.508: N2.A 44.44,31.75 38.99,31.75 36.89,31.75 R12.1
N$73
  Bottom 0.508: R13.1 81.98,32.64 76.45,32.64 N3.A
N$74
  Bottom 0.508: N4.A 98.55,32.64 93.01,32.64 90.17,29.8 R14.1
VCC  (via drill 0.35)
  Top 0.508: v55.5,42.16 50.29,47.37 | 50.29,47.37 45.85,47.37 45.21,46.74 v45.21,46.48 | 50.29,47.37 50.42,47.5 95.63,47.5 95.71,47.42 U$1.P$7 U$1.P$8 U$1.P$9 U$1.P$10 | v6.22,48.51 5.59,47.88 v5.59,39.75 5.59,12.57 6.35,11.81 v6.35,10.41 | v113.28,48.13 113.28,40.89 | IC4.5 112.01,39.62 113.28,40.89 | 113.28,40.89 v113.28,10.41
  Bottom 0.254: IC5.8 54.83,42.83 v55.5,42.16
  Bottom 0.508: IC5.10 55.17,41.83 v55.49,42.16 | v55.49,42.16 v55.5,42.16 | C12.2 65.55,37.01 X1.19 | U$1.P$9 U$1.P$10 U$1.P$8 98.33,46.1 98.47,46.1 | 98.47,46.1 C3.1 C4.1 105.79,46.1 108.1,48.41 113,48.41 v113.28,48.13 | 98.47,46.1 U$1.P$7 | X3.1 13.78,47.06 12.32,48.51 v6.22,48.51 | X1.19 65.97,36.59 R7.2 | v113.28,10.41 IC3.5 | X1.19 64.77,37.79 64.77,39.37 62.74,41.4 56.25,41.4 v55.49,42.16 | IC1.5 2.67,39.75 v5.59,39.75 | v6.35,10.41 IC2.5
  Bottom 1.016: X3.1 25.34,47.06 C1.1 C2.1 29.44,46.38 38.68,46.38 38.78,46.48 v45.21,46.48 C10.1
  other vias: 97.15,47.42 97.15,39.92 97.15,42.42 97.15,44.92

### Text on the board
tNames: IN14 Nixie Tube Clock / with ESP32 / by Erik Friedel
bNames: 5V | GND